# Altium schematic sheet Coolrunner_IO.SchDoc
size A4
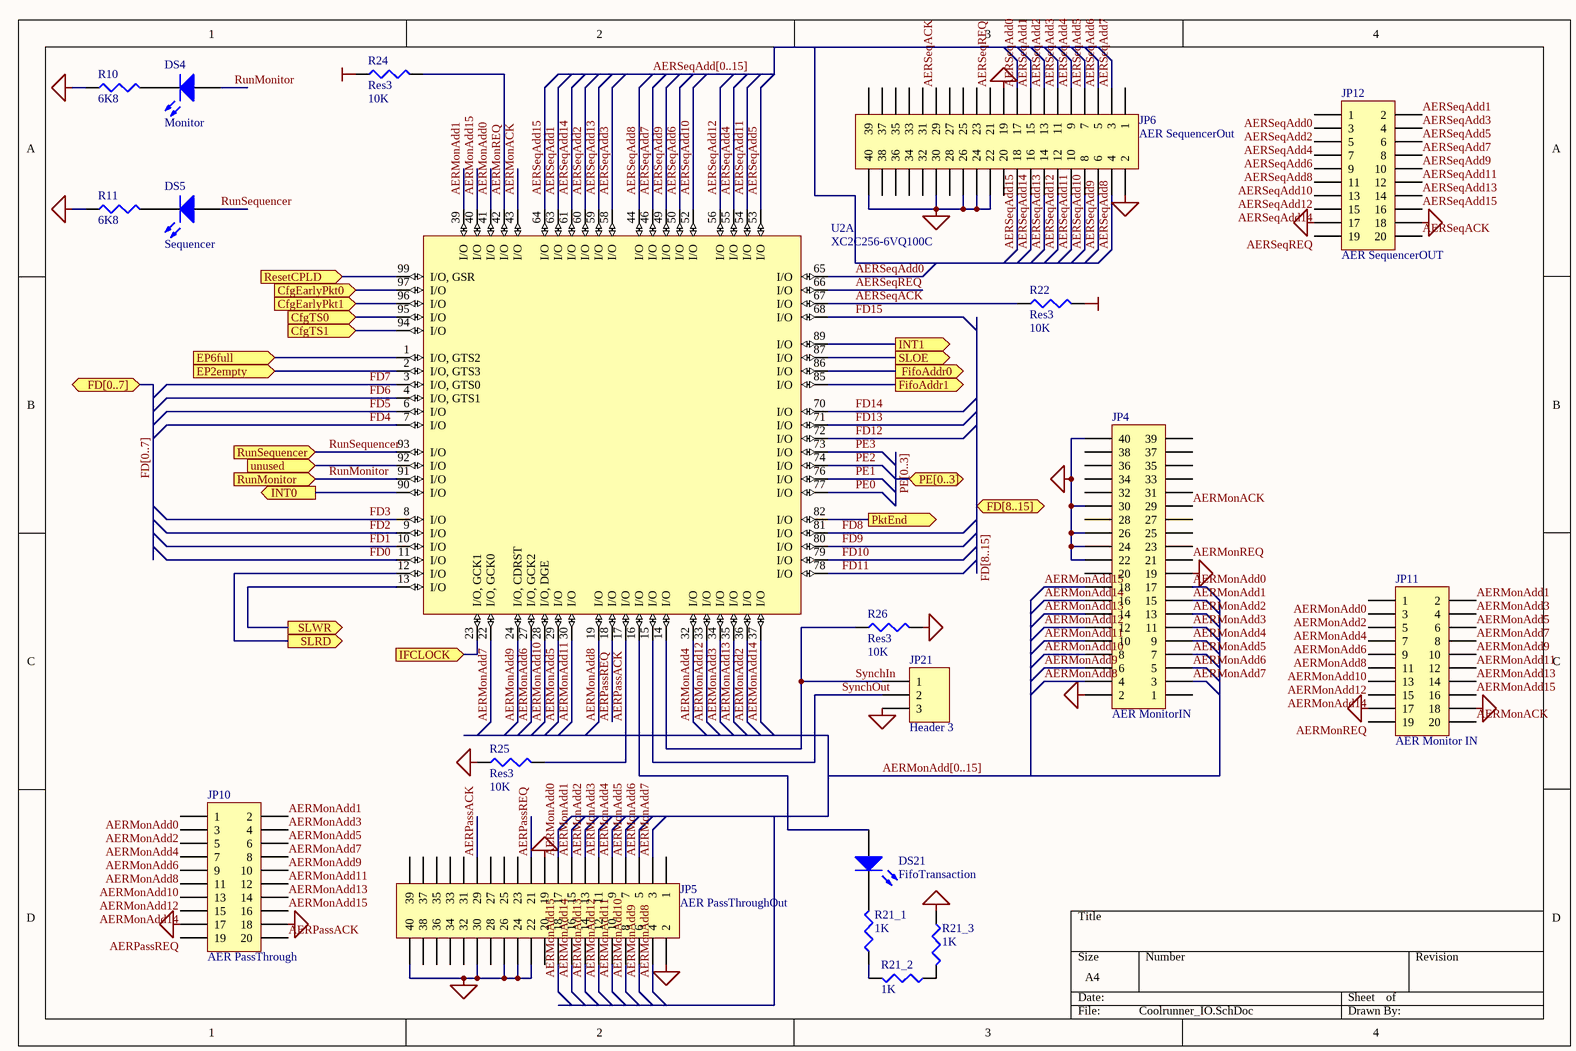
[diagram p0: Coolrunner_IO.SchDoc]

## Parts
DS4  Monitor  [LED]
DS5  Sequencer  [LED]
DS21  FifoTransaction  [LED]
JP4  AER MonitorIN  [IDC-40]
JP5  AER PassThroughOut  [IDC-40]
JP6  AER SequencerOut  [IDC-40]
JP10  AER PassThrough  [HDR10x2 w/clips]
JP11  AER Monitor IN  [HDR10x2 w/clips]
JP12  AER SequencerOUT  [HDR10x2 w/clips]
JP21  Header 3  [HDR1X3]
R10  value 6K8  [C1608-0603]  (hidden comment: Res3)
R11  value 6K8  [C1608-0603]  (hidden comment: Res3)
R21_1  value 1K  [C1608-0603]  (hidden comment: Res3)
R21_2  value 1K  [C1608-0603]  (hidden comment: Res3)
R21_3  value 1K  [C1608-0603]  (hidden comment: Res3)
R22  Res3  value 10K  [C1608-0603]
R24  Res3  value 10K  [C1608-0603]
R25  Res3  value 10K  [C1608-0603]
R26  Res3  value 10K  [C1608-0603]
U2  XC2C256-6VQ100C  [VQ100]  (part A of 2)

## Ports
CfgEarlyPkt0 (in), CfgEarlyPkt1 (in), CfgTS0 (in), CfgTS1 (in), EP2empty (in), EP6full (in), FD[0..7] (bidir), FD[8..15] (bidir), FifoAddr0 (out), FifoAddr1 (out), IFCLOCK (in), INT0 (out), INT1 (out), PE[0..3] (bidir), PktEnd (out), ResetCPLD (in), RunMonitor (in), RunSequencer (in), SLOE (out), SLRD (out), SLWR (out), unused (in)

## Nets
3.3V: R22.2 R24.1
GND: JP4.2 JP4.19 JP4.22 JP4.24 JP4.26 JP4.30 JP4.40 JP5.2 JP5.19 JP5.22 JP5.24 JP5.26 JP5.30 JP5.40 JP6.2 JP6.19 JP6.22 JP6.24 JP6.26 JP6.30 JP6.40 JP10.17 JP10.18 JP11.17 JP11.18 JP12.17 JP12.18 JP21.3 R10.1 R11.1 R21_3.1 R25.1 R26.2
AERMonACK: JP4.29 JP11.20 U2.43(I/O)
AERMonAdd0: JP4.17 JP5.17 JP10.1 JP11.1 U2.41(I/O)
AERMonAdd1: JP4.15 JP5.15 JP10.2 JP11.2 U2.39(I/O)
AERMonAdd2: JP4.13 JP5.13 JP10.3 JP11.3 U2.36(I/O)
AERMonAdd3: JP4.11 JP5.11 JP10.4 JP11.4 U2.34(I/O)
AERMonAdd4: JP4.9 JP5.9 JP10.5 JP11.5 U2.32(I/O)
AERMonAdd5: JP4.7 JP5.7 JP10.6 JP11.6 U2.29(I/O)
AERMonAdd6: JP4.5 JP5.5 JP10.7 JP11.7 U2.27(I/O,_GCK2)
AERMonAdd7: JP4.3 JP5.3 JP10.8 JP11.8 U2.22(I/O,_GCK0)
AERMonAdd8: JP4.4 JP5.4 JP10.9 JP11.9 U2.19(I/O)
AERMonAdd9: JP4.6 JP5.6 JP10.10 JP11.10 U2.24(I/O,_CDRST)
AERMonAdd10: JP4.8 JP5.8 JP10.11 JP11.11 U2.28(I/O,_DGE)
AERMonAdd11: JP4.10 JP5.10 JP10.12 JP11.12 U2.30(I/O)
AERMonAdd12: JP4.12 JP5.12 JP10.13 JP11.13 U2.33(I/O)
AERMonAdd13: JP4.14 JP5.14 JP10.14 JP11.14 U2.35(I/O)
AERMonAdd14: JP4.16 JP5.16 JP10.15 JP11.15 U2.37(I/O)
AERMonAdd15: JP4.18 JP5.18 JP10.16 JP11.16 U2.40(I/O)
AERMonREQ: JP4.21 JP11.19 R24.2 U2.42(I/O)
AERPassACK: JP5.29 JP10.20 R25.2 U2.17(I/O)
AERPassREQ: JP5.21 JP10.19 U2.18(I/O)
AERSeqACK: JP6.29 JP12.20 R22.1 U2.67(I/O)
AERSeqAdd0: JP6.17 JP12.1 U2.65(I/O)
AERSeqAdd1: JP6.15 JP12.2 U2.63(I/O)
AERSeqAdd2: JP6.13 JP12.3 U2.60(I/O)
AERSeqAdd3: JP6.11 JP12.4 U2.58(I/O)
AERSeqAdd4: JP6.9 JP12.5 U2.55(I/O)
AERSeqAdd5: JP6.7 JP12.6 U2.53(I/O)
AERSeqAdd6: JP6.5 JP12.7 U2.50(I/O)
AERSeqAdd7: JP6.3 JP12.8 U2.46(I/O)
AERSeqAdd8: JP6.4 JP12.9 U2.44(I/O)
AERSeqAdd9: JP6.6 JP12.10 U2.49(I/O)
AERSeqAdd10: JP6.8 JP12.11 U2.52(I/O)
AERSeqAdd11: JP6.10 JP12.12 U2.54(I/O)
AERSeqAdd12: JP6.12 JP12.13 U2.56(I/O)
AERSeqAdd13: JP6.14 JP12.14 U2.59(I/O)
AERSeqAdd14: JP6.16 JP12.15 U2.61(I/O)
AERSeqAdd15: JP6.18 JP12.16 U2.64(I/O)
AERSeqREQ: JP6.21 JP12.19 U2.66(I/O)
CfgEarlyPkt0: U2.97(I/O) ; port CfgEarlyPkt0
CfgEarlyPkt1: U2.96(I/O) ; port CfgEarlyPkt1
CfgTS0: U2.95(I/O) ; port CfgTS0
CfgTS1: U2.94(I/O) ; port CfgTS1
EP2empty: U2.2(I/O,_GTS3) ; port EP2empty
EP6full: U2.1(I/O,_GTS2) ; port EP6full
FD0: U2.11(I/O)
FD1: U2.10(I/O)
FD2: U2.9(I/O)
FD3: U2.8(I/O)
FD4: U2.7(I/O)
FD5: U2.6(I/O)
FD6: U2.4(I/O,_GTS1)
FD7: U2.3(I/O,_GTS0)
FD8: U2.81(I/O)
FD9: U2.80(I/O)
FD10: U2.79(I/O)
FD11: U2.78(I/O)
FD12: U2.72(I/O)
FD13: U2.71(I/O)
FD14: U2.70(I/O)
FD15: U2.68(I/O)
FifoAddr0: U2.86(I/O) ; port FifoAddr0
FifoAddr1: U2.85(I/O) ; port FifoAddr1
IFCLOCK: U2.23(I/O,_GCK1) ; port IFCLOCK
INT0: U2.90(I/O) ; port INT0
INT1: U2.89(I/O) ; port INT1
PE0: U2.77(I/O)
PE1: U2.76(I/O)
PE2: U2.74(I/O)
PE3: U2.73(I/O)
PktEnd: U2.82(I/O) ; port PktEnd
ResetCPLD: U2.99(I/O,_GSR) ; port ResetCPLD
RunMonitor: DS4.1(A) U2.91(I/O) ; port RunMonitor
RunSequencer: DS5.1(A) U2.93(I/O) ; port RunSequencer
SLOE: U2.87(I/O) ; port SLOE
SLRD: U2.12(I/O) ; port SLRD
SLWR: U2.13(I/O) ; port SLWR
SynchIn: JP21.1 R26.1 U2.14(I/O)
SynchOut: JP21.2 U2.15(I/O)
unused: U2.92(I/O) ; port unused
NetDS4_2: DS4.2(K) R10.2
NetDS5_2: DS5.2(K) R11.2
NetDS21_1: DS21.1(A) U2.16(I/O)
NetDS21_2: DS21.2(K) R21_1.2
NetR21_1_1: R21_1.1 R21_2.2
NetR21_2_1: R21_2.1 R21_3.2

Not connected (* = marked no-connect by the designer): JP4 1 20 23 25 27 28 31 32 33 34 35 36 37 38 39; JP5 1 20 23 25 27 28 31 32 33 34 35 36 37 38 39; JP6 1 20 23 25 27 28 31 32 33 34 35 36 37 38 39

## Buses and harness runs
bus AERMonAdd[0..15]
bus AERSeqAdd[0..15]
bus FD[0..7] = port FD[0..7]
bus FD[8..15] = port FD[8..15]
bus PE[0..3] = port PE[0..3]

## Library data of the parts
DS4 DS5 DS21 = LED2: Typical RED, GREEN, YELLOW, AMBER GaAs LED; pin to pad: 1>A 2>K; Published: 8-Jun-2000; Revision: July-2002: Re-released for DXP Platform.; Publisher: Altium Limited
JP4-JP6 = MHDR2X20: Header, 20-Pin, Dual row; Revision: 17-Jul-2002: Re-released for DXP Platform.; Publisher: Altium Limited
JP10-JP12 = Header 10X2: Header, 10-Pin, Dual row; Revision: 17-Jul-2002: Re-released for DXP Platform.; Publisher: Altium Limited
JP21 = Header 3: Header, 3-Pin; Revision: 17-Jul-2002: Re-released for DXP Platform.; Publisher: Altium Limited
R10 R11 R21_1-R21_3 R22 R24-R26 = Res3: Resistor; Published: 8-Jun-2000; Revision: July-2002: Re-released for DXP Platform.; Publisher: Altium Limited
U2 = XC2C256-6VQ100C: CoolRunner-II, 1.8V, 256 Macrocell CPLD, 100-Pin VQFP, Commercial Grade; PackageDocument: ver1.2, Jun-2004; Published: 23-Sep-2002; DatasheetDocument: ver2.3, Mar-2005; PackageReference: VQ100; Publisher: Altium Limited; Code_JEDEC: MS-026-AED; Code_IPC: SQFP14X14-100; ComponentLink1Description: Manufacturer Link; ComponentLink1URL: http://www.xilinx.com/xlnx/xil_prodcat_product.jsp?title=cr2_overview; ComponentLink2Description: Datasheet; ComponentLink2URL: http://direct.xilinx.com/bvdocs/publications/ds090.pdf